# Altium schematic sheet privado.SchDoc
size A4; SheetNumber: 4; SheetTotal: 5
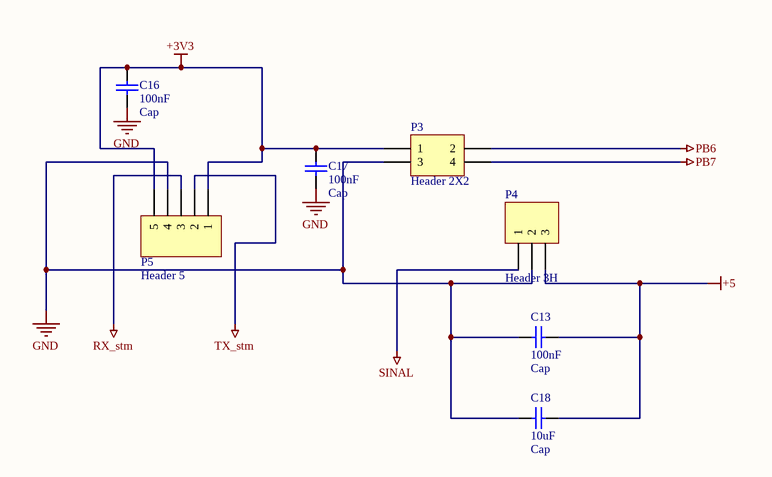
[diagram p0: privado.SchDoc]

## Parts
C13  Cap  value 100nF  [CAP100N]
C16  Cap  value 100nF  [CAP100N]
C17  Cap  value 100nF  [CAP100N]
C18  Cap  value 10uF  [CAP10uF]
P3  Header 2X2  [Borne 4 vias]
P4  Header 3H  [borne 3 vias]
P5  Header 5  [Borne 5 vias]

## Nets
+3V3: C16.2 C17.2 P3.1 P5.1 P5.5
+5: C13.2 C18.2 P4.3
GND: C13.1 C16.1 C17.1 C18.1 P3.3 P4.2 P5.4
PB6: P3.2
PB7: P3.4
RX_stm: P5.3
SINAL: P4.1
TX_stm: P5.2

## Library data of the parts
C13 C16-C18 = Cap: Capacitor; Published: 8-Jun-2000; LatestRevisionDate: 17-Jul-2002; LatestRevisionNote: Re-released for DXP Platform.; PackageReference: RAD-0.3; Publisher: Altium Limited; PackageDescription: Radial Cap, Thru-Hole; 2 Leads; 0.3 in Pin Spacing
P3 = Header 2X2: Header, 2-Pin, Dual row; LatestRevisionDate: 17-Jul-2002; LatestRevisionNote: Re-released for DXP Platform.; Publisher: Altium Limited
P4 = Header 3H: Header, 3-Pin, Right Angle; LatestRevisionDate: 17-Jul-2002; LatestRevisionNote: Re-released for DXP Platform.; Publisher: Altium Limited
P5 = Header 5: Header, 5-Pin; LatestRevisionDate: 17-Jul-2002; LatestRevisionNote: Re-released for DXP Platform.; Publisher: Altium Limited